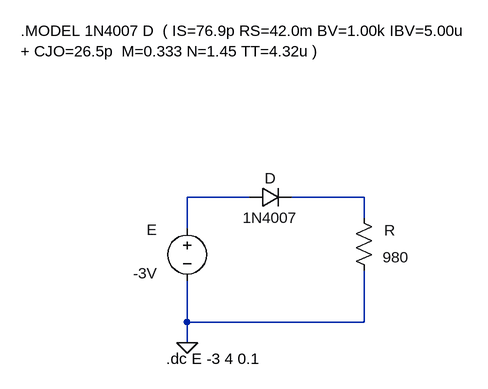
[diagram p0: schematic Atividade1.asc]
Atividade1.asc, the LTspice schematic file:
Version 4
SHEET 1 880 680
WIRE 176 96 80 96
WIRE 352 96 240 96
WIRE 352 128 352 96
WIRE 80 144 80 96
WIRE 80 288 80 224
WIRE 352 288 352 208
WIRE 352 288 80 288
WIRE 80 320 80 288
FLAG 80 320 0
SYMBOL res 336 112 R0
WINDOW 0 56 35 Center 2
WINDOW 3 45 76 Left 2
SYMATTR InstName R
SYMATTR Value 980
SYMBOL diode 176 112 R270
WINDOW 0 45 32 VCenter 2
WINDOW 3 0 32 VBottom 2
SYMATTR InstName D
SYMATTR Value 1N4007
SYMBOL voltage 80 128 R0
WINDOW 0 -54 18 Center 2
WINDOW 3 -64 85 Center 2
WINDOW 123 0 0 Left 0
WINDOW 39 0 0 Left 0
SYMATTR InstName E
SYMATTR Value -3V
TEXT 48 344 Left 2 !.dc E -3 4 0.1
TEXT -176 -160 Left 2 !.MODEL 1N4007 D  ( IS=76.9p RS=42.0m BV=1.00k IBV=5.00u\n+ CJO=26.5p  M=0.333 N=1.45 TT=4.32u )

The netlist it stands for:
* Atividade1.asc
R N002 0 980
D N001 N002 1N4007
V§E N001 0 -3V
.model D D
.lib standard.dio
.dc E -3 4 0.1
.MODEL 1N4007 D  ( IS=76.9p RS=42.0m BV=1.00k IBV=5.00u
+ CJO=26.5p  M=0.333 N=1.45 TT=4.32u )
.backanno
.end